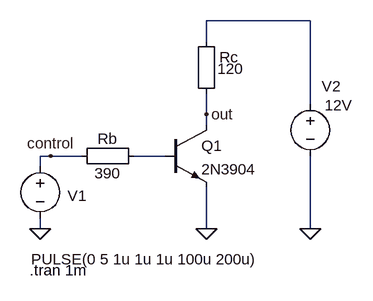
[diagram p0: schematic BJT_Switch.asc]
BJT_Switch.asc, the LTspice schematic file:
Version 4.1
SHEET 1 880 680
WIRE 432 -112 272 -112
WIRE 272 -80 272 -112
WIRE 432 16 432 -112
WIRE 272 32 272 0
WIRE 272 48 272 32
WIRE 32 96 16 96
WIRE 80 96 32 96
WIRE 208 96 160 96
WIRE 16 112 16 96
WIRE 16 208 16 192
WIRE 272 208 272 144
WIRE 432 208 432 96
FLAG 272 208 0
FLAG 16 208 0
FLAG 432 208 0
FLAG 32 96 control
FLAG 272 32 out
SYMBOL Misc\\EuropeanResistor 256 -96 R0
WINDOW 3 33 58 Left 2
SYMATTR Value 120
SYMATTR InstName Rc
SYMBOL Misc\\EuropeanResistor 176 80 R90
WINDOW 0 5 56 VBottom 2
WINDOW 3 27 56 VTop 2
SYMATTR InstName Rb
SYMATTR Value 390
SYMBOL voltage 16 96 R0
WINDOW 3 -14 159 Left 2
WINDOW 123 0 0 Left 2
WINDOW 39 0 0 Left 2
WINDOW 0 42 61 Left 2
SYMATTR Value PULSE(0 5 1u 1u 1u 100u 200u)
SYMATTR InstName V1
SYMBOL voltage 432 0 R0
WINDOW 3 22 18 Left 2
WINDOW 123 0 0 Left 2
WINDOW 39 0 0 Left 2
WINDOW 0 18 -11 Left 2
SYMATTR Value 12V
SYMATTR InstName V2
SYMBOL npn 208 48 R0
SYMATTR InstName Q1
SYMATTR Value 2N3904
TEXT 0 272 Left 2 !.tran 1m

The netlist it stands for:
* BJT_Switch.asc
Rc N001 out 120
Rb N002 control 390
V1 control 0 PULSE(0 5 1u 1u 1u 100u 200u)
V2 N001 0 12V
Q1 out N002 0 0 2N3904
.model NPN NPN
.model PNP PNP
.lib standard.bjt
.tran 1m
.backanno
.end